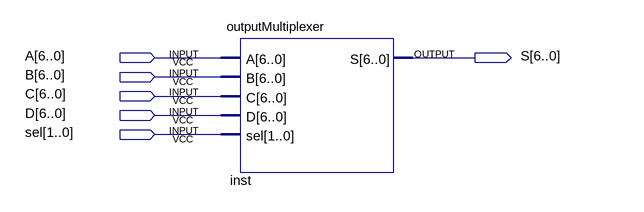
[diagram p0: schematic sheet]
// Quartus schematic testoutputmultiplexes.bdf as structural Verilog: 1 symbols, 6 pins
module testoutputmultiplexes (
  input  [6:0] A,
  input  [6:0] B,
  input  [6:0] C,
  input  [6:0] D,
  input  [1:0] sel,
  output [6:0] S
);

  outputMultiplexer inst (.A(A), .B(B), .C(C), .D(D), .sel(sel), .S(S));
endmodule
